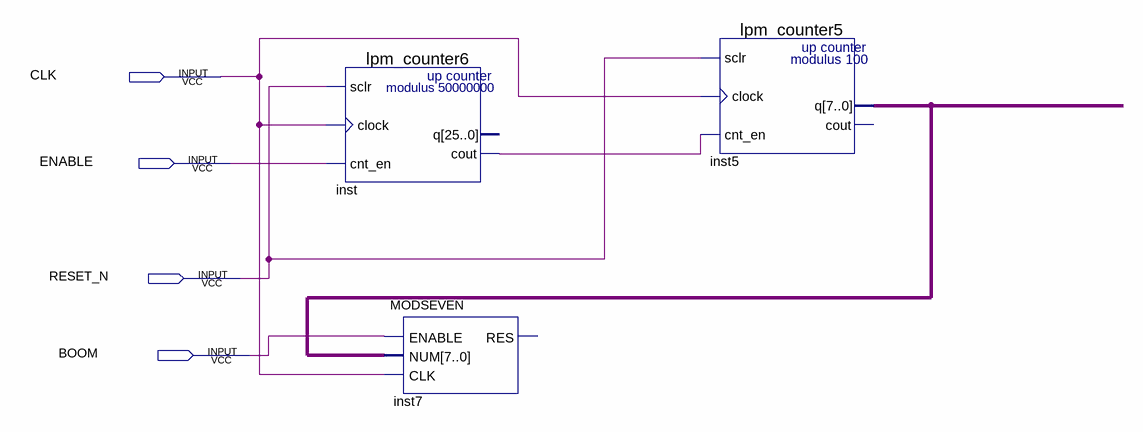
[diagram p0: schematic sheet]
// Quartus schematic MainBlock.bdf as structural Verilog: 3 symbols, 4 pins
module MainBlock (
  input  CLK,
  input  ENABLE,
  input  RESET_N,
  input  BOOM
);

  wire inst_cout;
  wire [7:0] inst5_q;

  lpm_counter6 inst (.sclr(RESET_N), .clock(CLK), .cnt_en(ENABLE), .cout(inst_cout));  // open: q
  MODSEVEN inst7 (.ENABLE(BOOM), .NUM(inst5_q), .CLK(CLK));  // open: RES
  lpm_counter5 inst5 (.sclr(RESET_N), .clock(CLK), .cnt_en(inst_cout), .q(inst5_q));  // open: cout
endmodule
